# EAGLE schematic ESD_FINAL_SCHEMATICS1 (EAGLE 9.5.0)
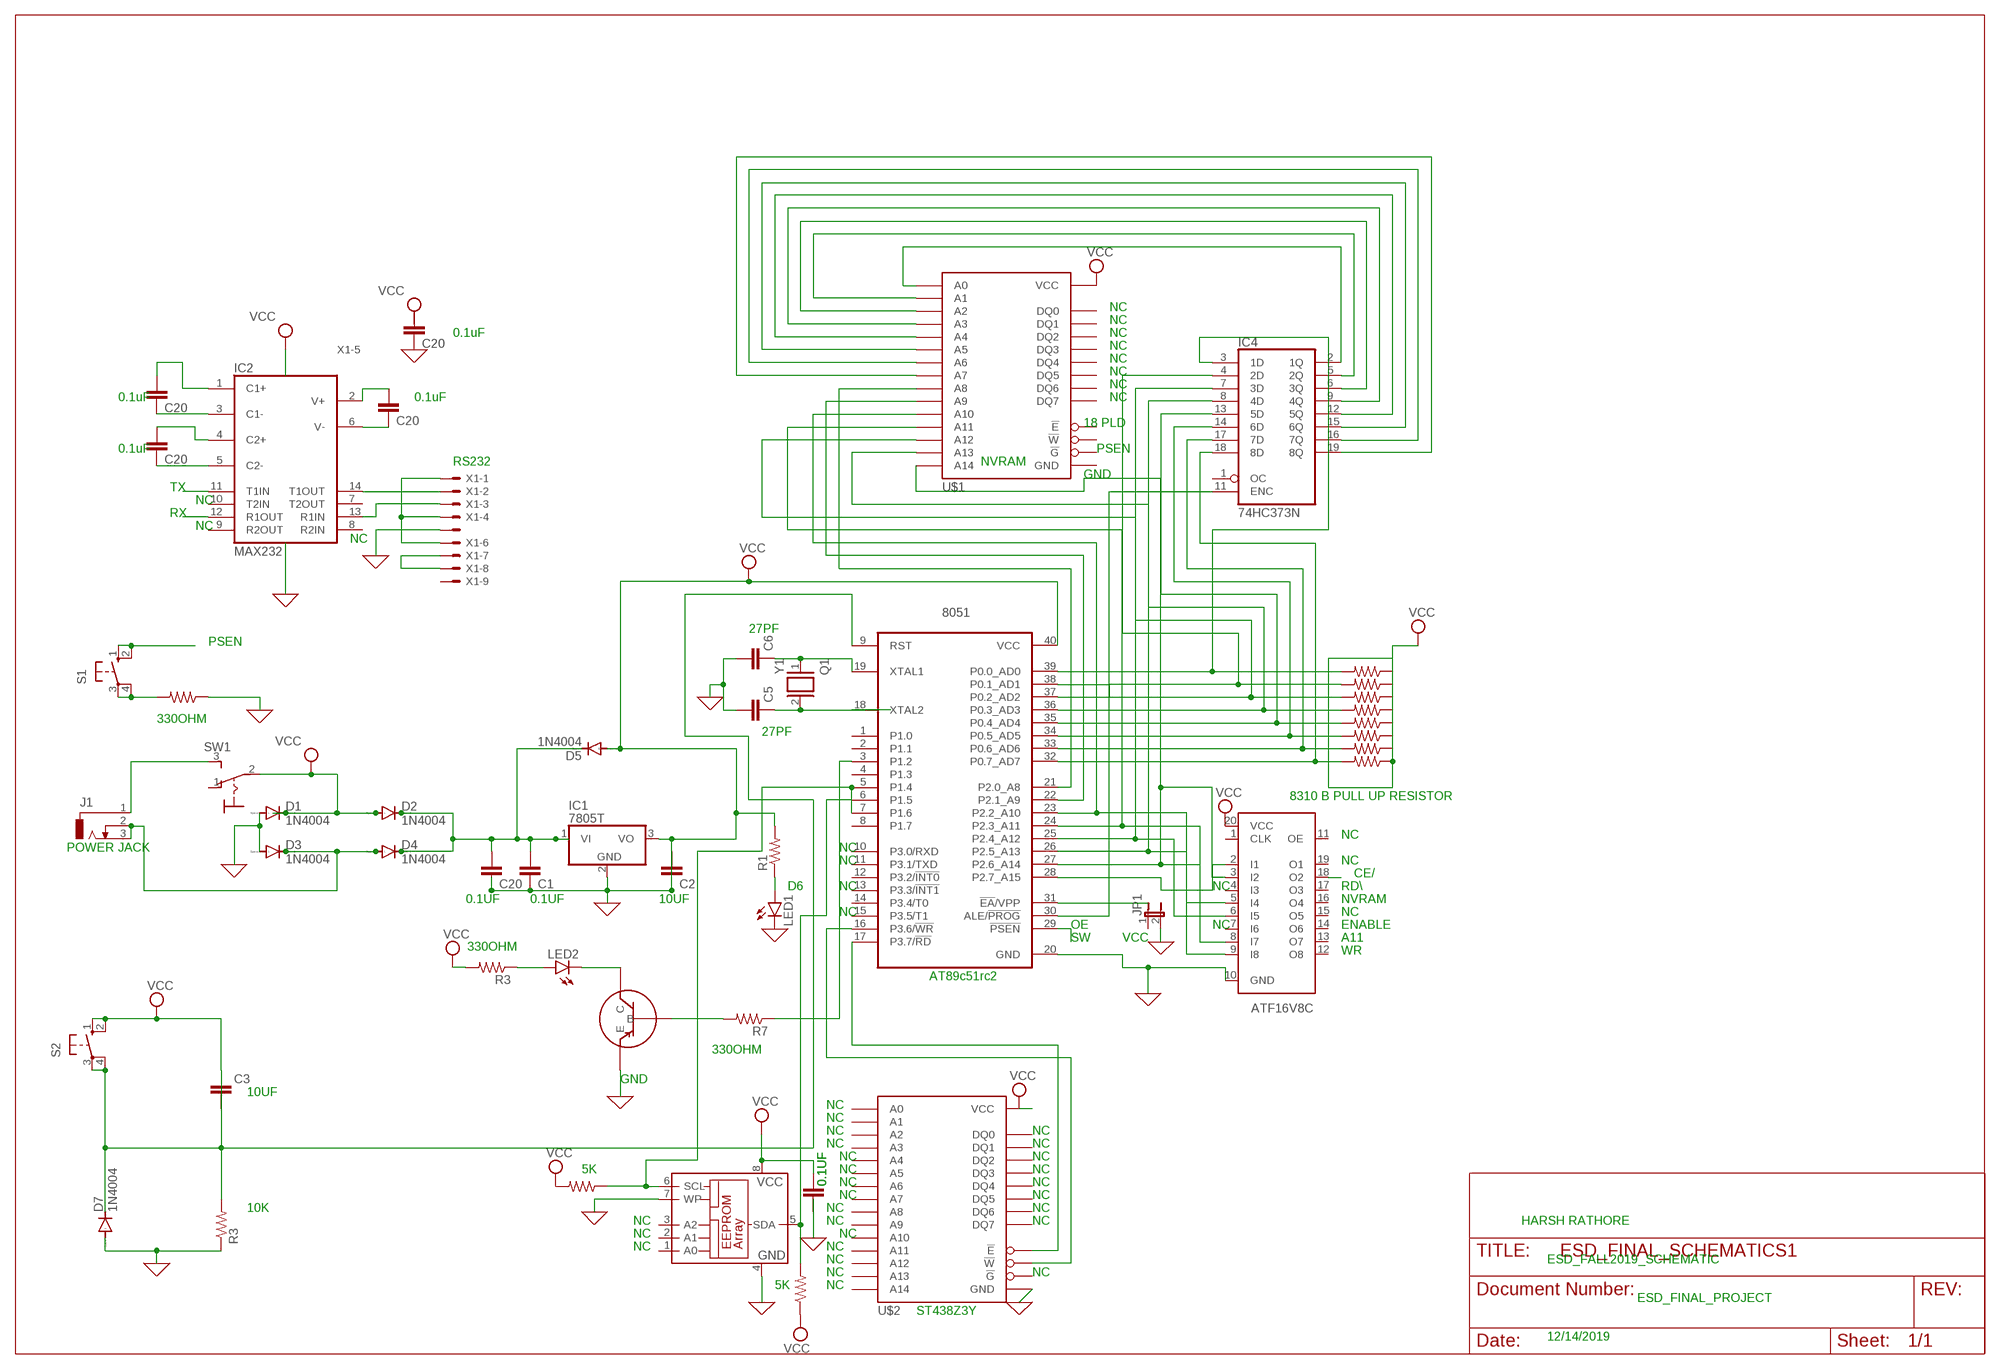
[diagram p0: schematic, sheet 1]

## Parts
8051  SAB-C501G  AT89C51-12PC  [DIL40]
ATF16V8C  ATF16V8BJ  [PLCC20]
C1  C6  C2,5-3  [C2.5-3]
C2  C2,5-3  [C2.5-3]
C3  C20  C2,5-3  [C2.5-3]
C4  C20  C2,5-3  [C2.5-3]
C5  C1  C2,5-3  [C2.5-3]
C6  C2  C2,5-3  [C2.5-3]
C7  C20  C2,5-3  [C2.5-3]
C8  C5  C2,5-3  [C2.5-3]
C9  C20  C2,5-3  [C2.5-3]
C10  C20  C2,5-3  [C2.5-3]
C31  C20  C2,5-3  [C2.5-3]
D1  1N4004  [DO41-10]
D2  1N4004  [DO41-10]
D3  1N4004  [DO41-10]
D4  1N4004  [DO41-10]
D5  1N4004  [DO41-10]
D7  1N4004  [DO41-10]
IC1  7805T  [TO220H]
IC2  MAX232  [DIL16]
IC3  24C01CP  [DIL8]
IC4  74HC373N  [DIL20]
J1  POWER JACK  DCJ0202  [DCJ0202]
JP1  JP1E  [JP1]
LED1  D6  LZ1-00WW05  [LZ1-00WW03]
LED2  D6  LZ1-00WW05  [LZ1-00WW03]
PULLUPRESISTORS  R-US_0204/2V  [0204V]
Q1  Y1  XTAL  [Q]
Q2  BJT_PNP  (no package)
R1  R-US_0204/2V  [0204V]
R2  R3  R-US_0204/2V  [0204V]
R3  R-US_0204/2V  [0204V]
R4  R-US_0204/2V  [0204V]
R5  R-US_0204/2V  [0204V]
R6  R-US_0204/2V  [0204V]
R7  R-US_0204/2V  [0204V]
R8  R-US_0204/2V  [0204V]
R9  R-US_0204/2V  [0204V]
R10  R-US_0204/2V  [0204V]
R11  R-US_0204/2V  [0204V]
R12  R-US_0204/2V  [0204V]
R13  R-US_0204/2V  [0204V]
R14  R-US_0204/2V  [0204V]
S1  10-XX  [B3F-10XX]
S2  10-XX  [B3F-10XX]
SW1  SW1  320-916  [320-916]
U$1  M48Z35Y  [RANDOM_DO_NOT_USE]
U$2  M48Z35Y  [RANDOM_DO_NOT_USE]
X1  22-23-2091  [22-23-2091]

## Nets
0: 8051.20(GND) ATF16V8C.10(GND) C1.1 C8.1 C9.2 C10.2 D1.A D3.A D7.A IC3.4(GND) IC3.7(WP) JP1.2 LED1.1(C) LED1.4(C) Q2.E R2.1 R12.1 U$2.P$27(GND) X1.5 ; supply symbol labelled GND
C3: 8051.9(RST) C2.1 C2.2 D7.C R2.2 S2.1(S) S2.2(S1) S2.3(P) S2.4(P1) ; supply symbol labelled VCC
N$1: 8051.19(XTAL1) C1.2 Q1.1
N$2: D3.C D4.A J1.2 J1.3
N$3: J1.1 SW1.3(S)
N$4: LED1.2(A) LED1.3(A) LED1.5(A) R1.1
N$5: IC4.19(8Q) U$1.P$11(A7)
N$6: C3.1 IC2.1(C1+)
N$7: 8051.18(XTAL2)
N$8: 8051.31(!EA!/VPP)
N$9: IC4.2(1Q) U$1.P$4(A0)
N$10: 8051.17(P3.7/!RD) U$2.P$1(!E)
N$11: 8051.26(P2.5_A13) ATF16V8C.5(I4) U$1.P$17(A13)
N$12: 8051.27(P2.6_A14) ATF16V8C.3(I2) U$1.P$18(A14)
N$13: 8051.16(P3.6/!WR) U$2.P$3(!W)
N$14: 8051.32(P0.7_AD7) IC4.18(8D) R11.2
N$15: 8051.33(P0.6_AD6) IC4.17(7D) R10.2
N$16: R8.1 R9.1 R10.1
N$17: 8051.24(P2.3_A11) ATF16V8C.8(I7) U$1.P$15(A11)
N$18: 8051.25(P2.4_A12) ATF16V8C.6(I5) U$1.P$16(A12)
N$19: 8051.3(P1.2) R7.1
N$20: PULLUPRESISTORS.1 R4.1 R5.1 R6.1
N$21: ATF16V8C.18(O2)
N$22: LED2.1(C) LED2.4(C) Q2.C
N$23: 8051.6(P1.5) IC3.5(SDA) R14.2
N$24: C5.1 C31.1 D2.C D4.C D5.C IC1.1(VI)
N$25: 8051.5(P1.4) 8051.7(P1.6) IC3.6(SCL) R13.1
N$26: 8051.30(ALE/!PROG) IC4.11(ENC)
N$27: LED2.2(A) LED2.3(A) LED2.5(A) R3.1
N$28: IC4.16(7Q) U$1.P$10(A6)
N$31: 8051.21(P2.0_A8) U$1.P$12(A8)
N$32: C8.2 Q1.2
N$33: C3.2 IC2.3(C1-)
N$34: 8051.23(P2.2_A10) ATF16V8C.9(I8) U$1.P$14(A10)
N$35: C4.1 IC2.4(C2+)
N$36: 8051.22(P2.1_A9) U$1.P$13(A9)
N$37: 8051.34(P0.5_AD5) IC4.14(6D) R9.2
N$38: C4.2 IC2.5(C2-)
N$39: 8051.35(P0.4_AD4) IC4.13(5D) R8.2
N$40: 8051.36(P0.3_AD3) IC4.8(4D) PULLUPRESISTORS.2
N$41: 8051.37(P0.2_AD2) IC4.7(3D) R4.2
N$42: 8051.38(P0.1_AD1) IC4.4(2D) R6.2
N$43: 8051.39(P0.0_AD0) IC4.3(1D) R5.2
N$44: IC2.11(T1IN)
N$45: IC2.12(R1OUT)
N$46: C7.1 IC2.2(V+)
N$47: IC2.14(T1OUT) X1.2
N$48: IC2.13(R1IN) X1.3
N$49: X1.1 X1.4 X1.6
N$50: C7.2 IC2.6(V-)
N$51: X1.7 X1.8
N$52: Q2.B R7.2
N$53: S1.1(S) S1.2(S1)
N$54: R12.2 S1.3(P) S1.4(P1)
N$55: 8051.28(P2.7_A15) ATF16V8C.2(I1)
N$56: 8051.29(!PSEN)
N$59: IC4.12(5Q) U$1.P$8(A4)
N$60: IC4.5(2Q) U$1.P$5(A1)
N$61: IC4.9(4Q) U$1.P$7(A3)
N$62: IC4.15(6Q) U$1.P$9(A5)
N$63: IC4.6(3Q) U$1.P$6(A2)
VCC: 8051.40(VCC) ATF16V8C.20(VCC) C5.2 C6.1 C6.2 C10.1 C31.2 D1.C D2.A D5.A IC1.2(GND) IC1.3(VO) IC3.8(VCC) R1.2 R3.2 R11.1 R13.2 R14.1 SW1.2(P) U$1.P$28(VCC) U$2.P$28(VCC) ; supply symbol labelled GND
Unconnected: 8051.1(P1.0) 8051.2(P1.1) 8051.4(P1.3) 8051.8(P1.7) 8051.10(P3.0/RXD) 8051.11(P3.1/TXD) 8051.12(P3.2/!INT0) 8051.13(P3.3/!INT1) 8051.14(P3.4/T0) 8051.15(P3.5/T1) ATF16V8C.1(CLK) ATF16V8C.4(I3) ATF16V8C.7(I6) ATF16V8C.11(OE) ATF16V8C.12(O8) ATF16V8C.13(O7) ATF16V8C.14(O6) ATF16V8C.15(O5) ATF16V8C.16(O4) ATF16V8C.17(O3) ATF16V8C.19(O1) C9.1 IC2.7(T2OUT) IC2.8(R2IN) IC2.9(R2OUT) IC2.10(T2IN) IC3.1(A0) IC3.2(A1) IC3.3(A2) IC4.1(OC) JP1.1 SW1.1(O) U$1.P$1(!E) U$1.P$2(!G) U$1.P$3(!W) U$1.P$19(DQ0) U$1.P$20(DQ1) U$1.P$21(DQ2) U$1.P$22(DQ3) U$1.P$23(DQ4) U$1.P$24(DQ5) U$1.P$25(DQ6) U$1.P$26(DQ7) U$1.P$27(GND) U$2.P$2(!G) U$2.P$4(A0) U$2.P$5(A1) U$2.P$6(A2) U$2.P$7(A3) U$2.P$8(A4) U$2.P$9(A5) U$2.P$10(A6) U$2.P$11(A7) U$2.P$12(A8) U$2.P$13(A9) U$2.P$14(A10) U$2.P$15(A11) U$2.P$16(A12) U$2.P$17(A13) U$2.P$18(A14) U$2.P$19(DQ0) U$2.P$20(DQ1) U$2.P$21(DQ2) U$2.P$22(DQ3) U$2.P$23(DQ4) U$2.P$24(DQ5) U$2.P$25(DQ6) U$2.P$26(DQ7) X1.9

## Notes on the sheet
- NC
- NC
- 0.1uF | NC
- NC
- NC
- NC
- NC
- 0.1uF | 0.1uF | NC
- 18 PLD
- 0.1uF | PSEN
- RS232 | NVRAM
- GND
- TX
- NC
- RX
- NC
- NC
- 27PF
- PSEN
- 330OHM
- 27PF
- 8310 B PULL UP RESISTOR
- NC
- POWER JACK | NC
- NC | NC
- CE/
- D6 | NC | NC | RD\
- 0.1UF | 0.1UF | 10UF | NVRAM
- NC | NC
- OE | NC | ENABLE
- 330OHM | SW | VCC | A11
- WR
- AT89c51rc2
- 330OHM
- GND
- 10UF
- NC
- NC
- NC | NC
- NC | NC
- NC | NC
- 5K | NC | NC
- 0.1UF | 0.1UF | NC | NC
- NC | NC
- 10K | NC | NC
- NC | NC | NC | HARSH RATHORE
- NC | NC
- NC | NC
- NC | ESD_FALL2019_SCHEMATIC
- NC | NC
- 5K | NC
- ESD_FINAL_PROJECT
- ST438Z3Y
- 12/14/2019

## Power pins joined to a net without a drawn wire
GND: IC2.15(GND) IC4.10(GND)
VCC: IC2.16(VCC) IC4.20(VCC)

## Library data of the parts
8051 = atmel:AT89C51-*: 8-bit Microcontroller with 4K Bytes Flash Not Recommended for New Designs. Use AT89S51. Source: http://www.atmel.com/dyn/resources/prod_documents/doc0265.; OC_FARNELL: unknown; OC_NEWARK: unknown; SPICEPREFIX: X
ATF16V8C = atmel:ATF16V8B: High perfomance CMOS (electrically erasable) programmable logic device (PLD) ABLE-Atmel-ABEL - P18V8R, P16V8C, P16V8AS, P17V8 COPL Atmel-WinCUPL - G16V8MS, G16V8MA, G16V8AS, G16V8 LOG/IC - GAL16V8_R, GAL16V8_G7, GAL16V8_C), GAL16V8 Tango-PLD - G16V8R, G16V8C, G16V8AS, G16V8 Source: http://www.atmel.com/dyn/resources/prod_documents/DOC0364.PDF; MPN: ATF16V8CZ-15JU; OC_FARNELL: 1551767; OC_NEWARK: 94M6253
C1-C10 C31 = capacitor-wima:C: CAPACITOR naming: grid - package width
D1-D5 D7 = diode:1N4004: DIODE general purpose rectifier, 1 A
IC1 = linear:78*: Positive VOLTAGE REGULATOR Source: http://cache.national.com/ds/LM/LM78L05.pdf http://www.fairchildsemi.com/ds/LM/LM7805.pdf
IC2 = maxim:MAX232: RS232 TRANSCEIVER; MF: MAXIM; MPN: MAX232ACPE+; OC_FARNELL: 9723773; OC_NEWARK: 68K4544
IC3 = microchip:24C*: Serial EEPROM 1 K/2 K/4 K; MF: MICROCHIP; MPN: 24C01C/P; OC_FARNELL: 3662901; OC_NEWARK: 96K4060
IC4 = 74xx-eu:74*373: Octal D type transparent LATCH, edge triggered
J1 = con-jack:DCJ0202: DC POWER JACK Source: DCJ0202.pdf; OC_FARNELL: unknown; OC_NEWARK: unknown
JP1 = jumper:JP1E: JUMPER
LED1 LED2 = led:LZ1-00WW05: High Luminous Efficacy 5W Warm White LED Source: http://www.ledengin.com/products/5wLZ/LZ1-00WW05.pdf
PULLUPRESISTORS R1-R14 = rcl:R-US_: RESISTOR, American symbol; SPICEPREFIX: R
Q1 = special:XTAL: CRYSTAL
Q2 = ngspice-simulation:BJT_PNP: Bipolar PNP Transistor
S1 S2 = switch-omron:10-XX: OMRON SWITCH; MPN: B3F-1000; OC_FARNELL: 176432; OC_NEWARK: 36M3542
SW1 = switch:320-916: TOGGLE SWITCH distributor RS Components
U$1 U$2 = M48Z35Y:M48Z35Y: M48Z35Y st memory nvram esd wrong foorprint
X1 = con-molex:22-23-2091: .100" (2.54mm) Center Header - 9 Pin; MF: MOLEX; MPN: 22-23-2091; OC_FARNELL: 1756827; OC_NEWARK: 56H0450